# EasyEDA schematic Sheet_1.json
TITLE: Sheet_1; REV: 1.0; Date: 2022-05-23; Sheet: 1/1; Drawn By: shakilasheisenberg; Company: Your Company
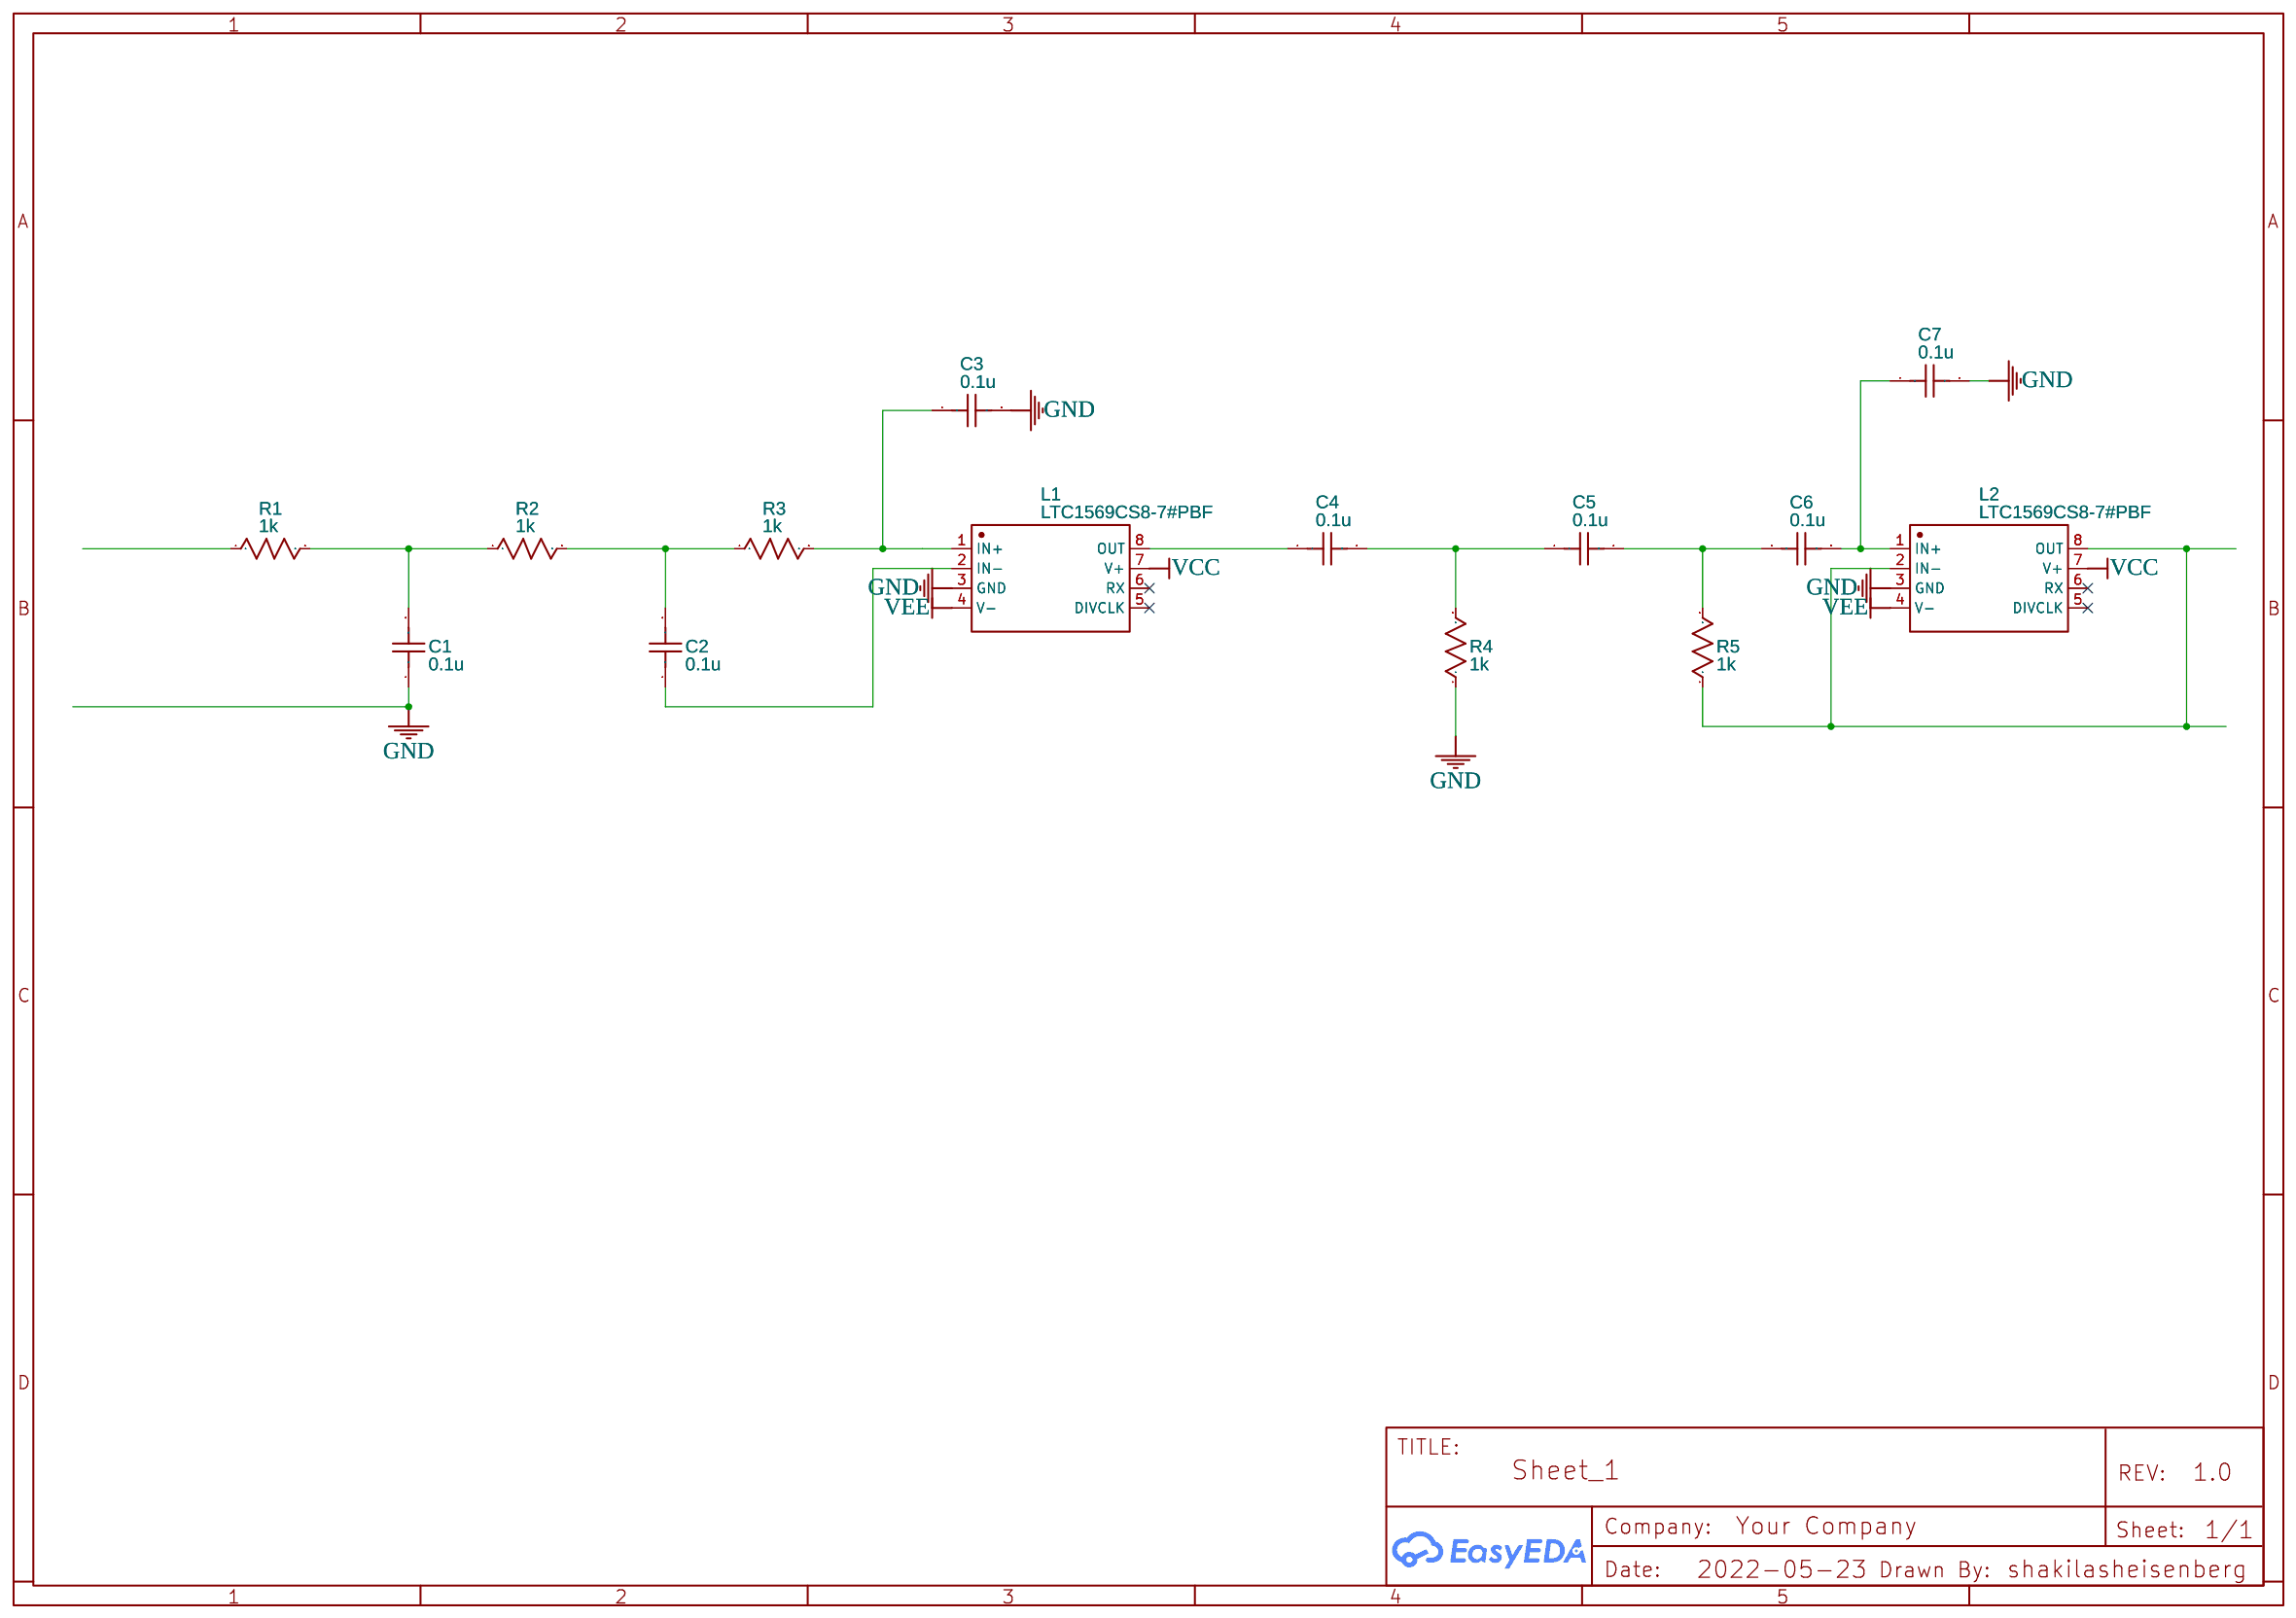
[diagram p0: schematic sheet]

## Parts
C1  0.1u  [C0603]
C2  0.1u  [C0603]
C3  0.1u  [C0603]
C4  0.1u  [C0603]
C5  0.1u  [C0603]
C6  0.1u  [C0603]
C7  0.1u  [C0603]
L1  LTC1569CS8-7#PBF  [SOIC-8_L4.9-W3.9-P1.27-LS6.0-BL]
L2  LTC1569CS8-7#PBF  [SOIC-8_L4.9-W3.9-P1.27-LS6.0-BL]
R1  1k  [R0603]
R2  1k  [R0603]
R3  1k  [R0603]
R4  1k  [R0603]
R5  1k  [R0603]

## Library data of the parts
C1-C7 = C_0603_US: Contributor: LCEDA_Lib
L1 L2 = LTC1569CS8-7#PBF: Supplier: LCSC; Manufacturer: LINEAR; Supplier Part: C117415; JLCPCB Part Class: Extended Part
R1-R5 = R_0603_US: Contributor: LCEDA_Lib

## Nets
GND: C1.1 C3.2 C7.2 L1.3(GND) L2.3(GND) R4.1
VCC: L1.7(V+) L2.7(V+)
VEE: L1.4(V-) L2.4(V-)
Net-(C1-2): C1.2 R1.2 R2.1
Net-(C2-1): C2.1 L1.2(IN-)
Net-(C2-2): C2.2 R2.2 R3.1
Net-(C3-1): C3.1 L1.1(IN+) R3.2
Net-(C4-1): C4.1 L1.8(OUT)
Net-(C4-2): C4.2 C5.1 R4.2
Net-(C5-2): C5.2 C6.1 R5.2
Net-(C6-2): C6.2 C7.1 L2.1(IN+)
Net-(L2-2): L2.2(IN-) L2.8(OUT) R5.1

Not connected (* = marked no-connect by the designer): L1 5(DIVCLK)* 6(RX)*; L2 5(DIVCLK)* 6(RX)*; R1 1
